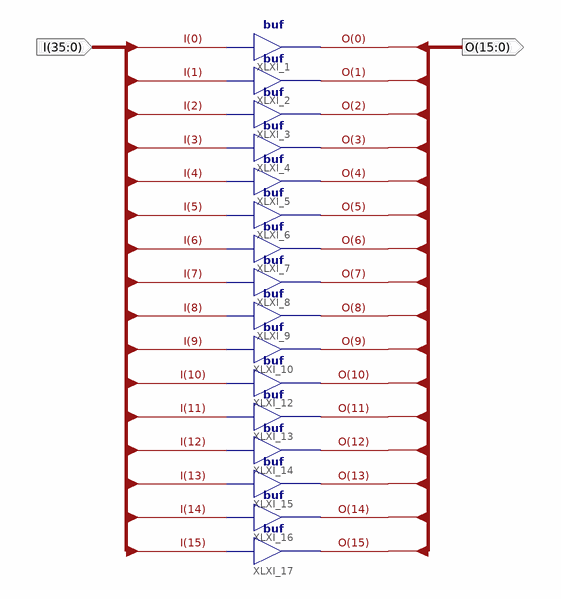
[diagram p0: schematic sheet 1]
// Xilinx ISE schematic resize36x16l.sch (spartan6) as structural Verilog: 16 symbols, 2 ports
module resize36x16l (
  input  [35:0] I,
  output [15:0] O
);

  buf XLXI_1 (O[0], I[0]);
  buf XLXI_2 (O[1], I[1]);
  buf XLXI_3 (O[2], I[2]);
  buf XLXI_4 (O[3], I[3]);
  buf XLXI_5 (O[4], I[4]);
  buf XLXI_6 (O[5], I[5]);
  buf XLXI_7 (O[6], I[6]);
  buf XLXI_8 (O[7], I[7]);
  buf XLXI_9 (O[8], I[8]);
  buf XLXI_10 (O[9], I[9]);
  buf XLXI_12 (O[10], I[10]);
  buf XLXI_13 (O[11], I[11]);
  buf XLXI_14 (O[12], I[12]);
  buf XLXI_15 (O[13], I[13]);
  buf XLXI_16 (O[14], I[14]);
  buf XLXI_17 (O[15], I[15]);
endmodule
